# Altium project slider_V01.PrjPcb
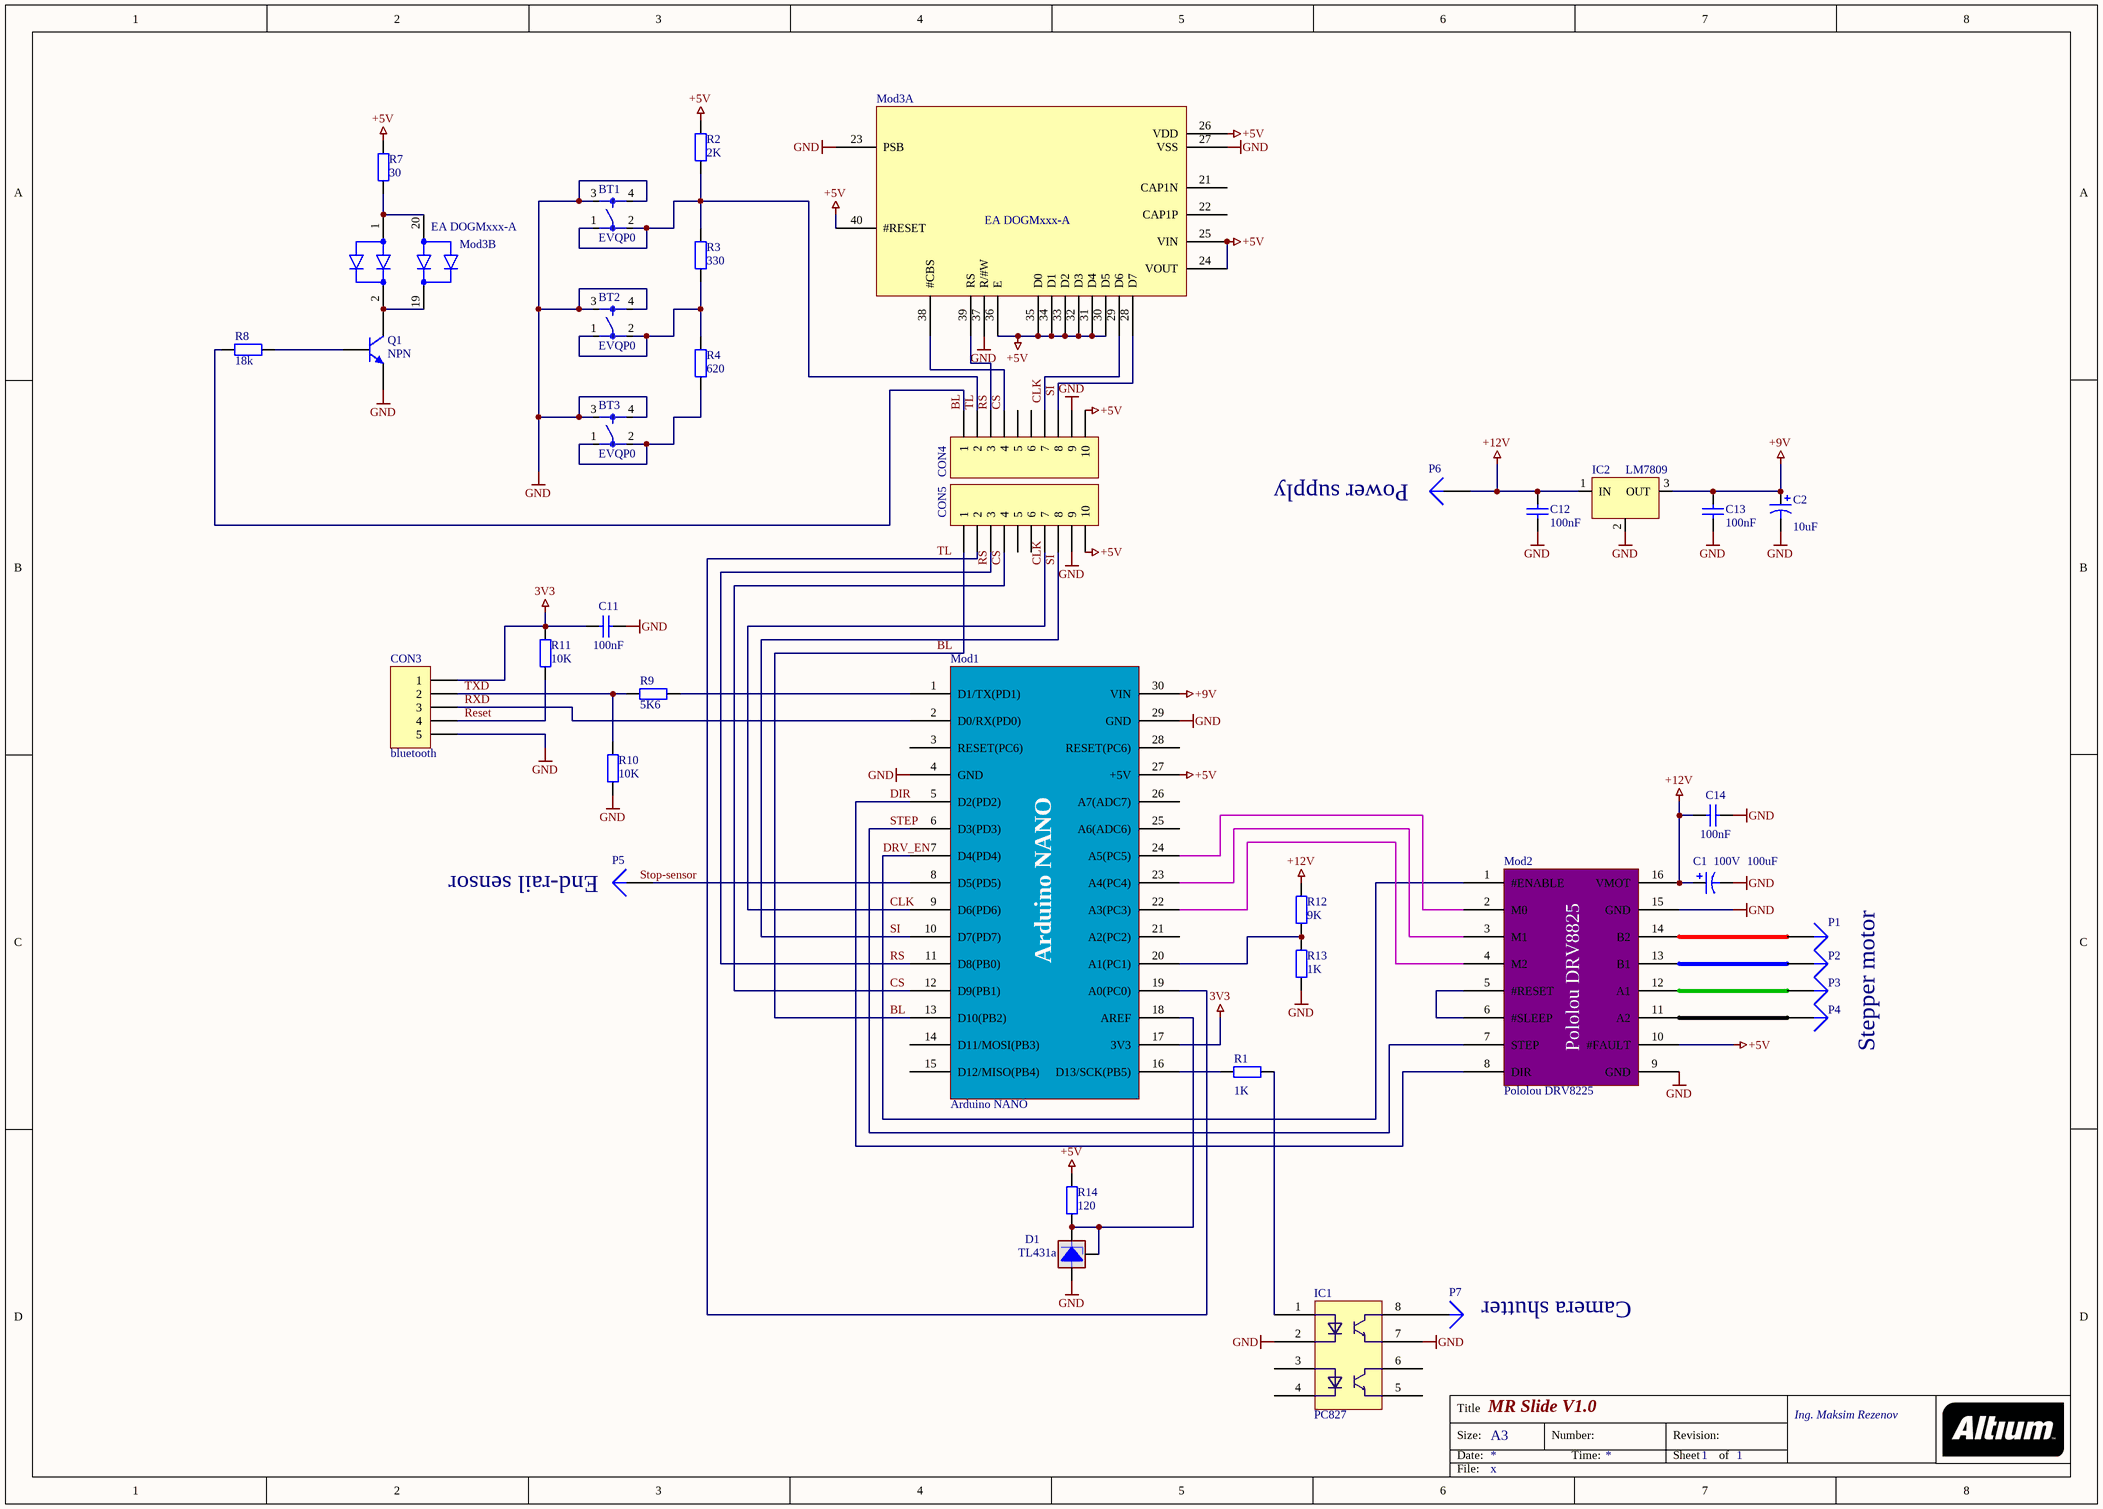
[diagram p0: slider_V01.SchDoc]
1 sheet, 38 parts. Net scope: global (net labels, ports and power ports of the same name join across sheets).
Board files: slider_V01_displayboard.PcbDoc, slider_V01.PcbDoc

## Sheet slider_V01.SchDoc: MR Slide V1.0
size A3; Author: Maksim Rezenov; DrawnBy: Maksim Rezenov; Engineer: Maksim Rezenov; Address1: Ing. Maksim Rezenov; SheetNumber: 1; SheetTotal: 1; DocumentFullPathAndName: x; ProjectName: MR slider V1.0

### Parts
BT1  EVQP0  [EVQP0]
BT2  EVQP0  [EVQP0]
BT3  EVQP0  [EVQP0]
C1  100V  value 100uF  [CAPR5-4X5]
C2  value 10uF  [1812]  (hidden comment: Cap Pol3)
C11  value 100nF  [C1206]  (hidden comment: Cap Semi)
C12  value 100nF  [C1206]  (hidden comment: Cap Semi)
C13  value 100nF  [C1206]  (hidden comment: Cap Semi)
C14  value 100nF  [C1206]  (hidden comment: Cap Semi)
CON3  bluetooth  [HDR1X5]
CON4  Header 10  [HDR1X10]  (value not drawn)
CON5  Header 10  [HDR1X10]  (value not drawn)
D1  TL431a  [SOT23-3]
IC1  PC827  [DIP-8]
IC2  LM7809  [SOT89M]
Mod1  Arduino NANO  [arduino nano]
Mod2  Pololou DRV8225  [Pololou DRV8225]
Mod3  EA DOGMxxx-A  [EA DOGMxxx-A]  (parts A,B of 2)
P1  Plug  [PIN1]  (value not drawn)
P2  Plug  [PIN1]  (value not drawn)
P3  Plug  [PIN1]  (value not drawn)
P4  Plug  [PIN1]  (value not drawn)
P5  Plug  [PIN1]  (value not drawn)
P6  Plug  [PIN1]  (value not drawn)
P7  Plug  [PIN1]  (value not drawn)
Q1  NPN  [SOT23_N]
R1  value 1K  [C1206]  (hidden comment: Res2)
R2  value 2K  [C1206]  (hidden comment: Res2)
R3  value 330  [C1206]  (hidden comment: Res2)
R4  value 620  [C1206]  (hidden comment: Res2)
R7  value 30  [C1206]  (hidden comment: Res2)
R8  value 18k  [C1206]  (hidden comment: Res2)
R9  value 5K6  [C1206]  (hidden comment: Res2)
R10  value 10K  [C1206]  (hidden comment: Res2)
R11  value 10K  [C1206]  (hidden comment: Res2)
R12  value 9K  [C1206]  (hidden comment: Res2)
R13  value 1K  [C1206]  (hidden comment: Res2)
R14  value 120  [C1206]  (hidden comment: Res2)

### Nets
3V3: C11.1 CON3.1 Mod1.17(3V3) R11.2
+5V: CON4.10 CON5.10 Mod1.27(+5V) Mod2.10(#FAULT) Mod3.24(VOUT) Mod3.25(VIN) Mod3.26(VDD) Mod3.30(D5) Mod3.31(D4) Mod3.32(D3) Mod3.33(D2) Mod3.34(D1) Mod3.35(D0) Mod3.36(E) Mod3.40(#RESET) R2.2 R7.2 R14.2
+9V: C2.1 C13.2 IC2.3(OUT) Mod1.30(VIN)
+12V: C1.1 C12.2 C14.1 IC2.1(IN) Mod2.16(VMOT) P6.1 R12.2
GND: BT1.3 BT1.4 BT2.3 BT2.4 BT3.3 BT3.4 C1.2 C2.2 C11.2 C12.1 C13.1 C14.2 CON3.5 CON4.9 CON5.9 D1.3(A) IC1.2 IC1.7 IC2.2(GND) Mod1.4(GND) Mod1.29(GND) Mod2.9(GND) Mod2.15(GND) Mod3.23(PSB) Mod3.27(VSS) Mod3.37(R/#W) Q1.3(E) R10.1 R13.1
BL: CON4.1 CON5.1 Mod1.13(D10(PB2)) R8.2
CLK: CON4.7 CON5.7 Mod1.9(D6(PD6)) Mod3.29(D6)
CS: CON4.4 CON5.4 Mod1.12(D9(PB1)) Mod3.38(#CBS)
DIR: Mod1.5(D2(PD2)) Mod2.8(DIR)
DRV_EN: Mod1.7(D4(PD4)) Mod2.1(#ENABLE)
Reset: CON3.4 R11.1
RS: CON4.3 CON5.3 Mod1.11(D8(PB0)) Mod3.39(RS)
RXD: CON3.3 Mod1.2(D0/RX(PD0))
SI: CON4.8 CON5.8 Mod1.10(D7(PD7)) Mod3.28(D7)
STEP: Mod1.6(D3(PD3)) Mod2.7(STEP)
TL: BT1.1 BT1.2 CON4.2 CON5.2 Mod1.19(A0(PC0)) R2.1 R3.2
TXD: CON3.2 R9.1 R10.2
NetBT2_1: BT2.1 BT2.2 R3.1 R4.2
NetBT3_1: BT3.1 BT3.2 R4.1
NetD1_1: D1.1(C) D1.2(R) Mod1.18(AREF) R14.1
NetIC1_1: IC1.1 R1.2
NetIC1_8: IC1.8 P7.1
NetMod1_1: Mod1.1(D1/TX(PD1)) R9.2
NetMod1_8: Mod1.8(D5(PD5)) P5.1
NetMod1_16: Mod1.16(D13/SCK(PB5)) R1.1
NetMod1_20: Mod1.20(A1(PC1)) R12.1 R13.2
NetMod1_22: Mod1.22(A3(PC3)) Mod2.4(M2)
NetMod1_23: Mod1.23(A4(PC4)) Mod2.3(M1)
NetMod1_24: Mod1.24(A5(PC5)) Mod2.2(M0)
NetMod2_5: Mod2.5(#RESET) Mod2.6(#SLEEP)
NetMod2_11: Mod2.11(A2) P4.1
NetMod2_12: Mod2.12(A1) P3.1
NetMod2_13: Mod2.13(B1) P2.1
NetMod2_14: Mod2.14(B2) P1.1
NetMod3_1: Mod3.1(A1) Mod3.20 R7.1
NetMod3_2: Mod3.2 Mod3.19 Q1.1(C)
NetQ1_2: Q1.2(B) R8.1

Not connected (* = marked no-connect by the designer): CON4 5 6; CON5 5 6; IC1 3 4 5 6; Mod1 3(RESET(PC6)) 14(D11/MOSI(PB3)) 15(D12/MISO(PB4)) 21(A2(PC2)) 25(A6(ADC6)) 26(A7(ADC7)) 28(RESET(PC6)); Mod3 21(CAP1N) 22(CAP1P)

### Notes on the sheet
- (near P6) Power supply
- (near P5) End-rail sensor
- Stepper motor
- (near P7) Camera shutter
- Labels drawn without touching a wire or pin: Stop-sensor
- Title
- Size:
- Date:
- A3
- Number:
- Time:
- Revision:
- Sheet
- of
- File:
- (in symbol Pololou DRV8225) Pololou DRV8825

### Library data of the parts
C1 C2 = Cap Pol3: Polarized Capacitor (Surface Mount); Published: 8-Jun-2000; LatestRevisionDate: 29-May-2009; LatestRevisionNote: IPC-7351 Footprint Added.; PackageReference: C0805; Publisher: Altium Limited; PackageDescription: Chip Capacitor
C11-C14 = Cap Semi: Capacitor (Semiconductor SIM Model); Published: 8-Jun-2000; LatestRevisionDate: 29-May-2009; LatestRevisionNote: IPC-7351 Footprint Added.; PackageReference: C1206; Publisher: Altium Limited; PackageDescription: Chip Capacitor
CON3 = Header 5: Header, 5-Pin; LatestRevisionDate: 17-Jul-2002; LatestRevisionNote: Re-released for DXP Platform.; Publisher: Altium Limited
CON4 CON5 = Header 10: Header, 10-Pin; LatestRevisionDate: 17-Jul-2002; LatestRevisionNote: Re-released for DXP Platform.; Publisher: Altium Limited
IC2 = LM780x
Q1 = NPN: NPN Bipolar Transistor; Published: 8-Jun-2000; LatestRevisionDate: 17-Jul-2002; LatestRevisionNote: Re-released for DXP Platform.; PackageReference: TO-226-AA; Publisher: Altium Limited; PackageDescription: TO, Flat Index; 3 In-Line, Axial Leads; Body Dia. 4.8mm; Leads 0.55 x 0.51 mm (max); Code_JEDEC: TO-226-AA
R1-R4 R7-R14 = Res2: Resistor; Published: 8-Jun-2000; LatestRevisionDate: 17-Jul-2002; LatestRevisionNote: Re-released for DXP Platform.; PackageReference: AXIAL-0.4; Publisher: Altium Limited; PackageDescription: Axial Device, Thru-Hole; 2 Leads; 0.4 in Pin Spacing
P1-P7 = Plug: LatestRevisionDate: 17-Jul-2002; LatestRevisionNote: Re-released for DXP Platform.; Publisher: Altium Limited